# EAGLE design RTD Sesnor (EAGLE 9.6.2)
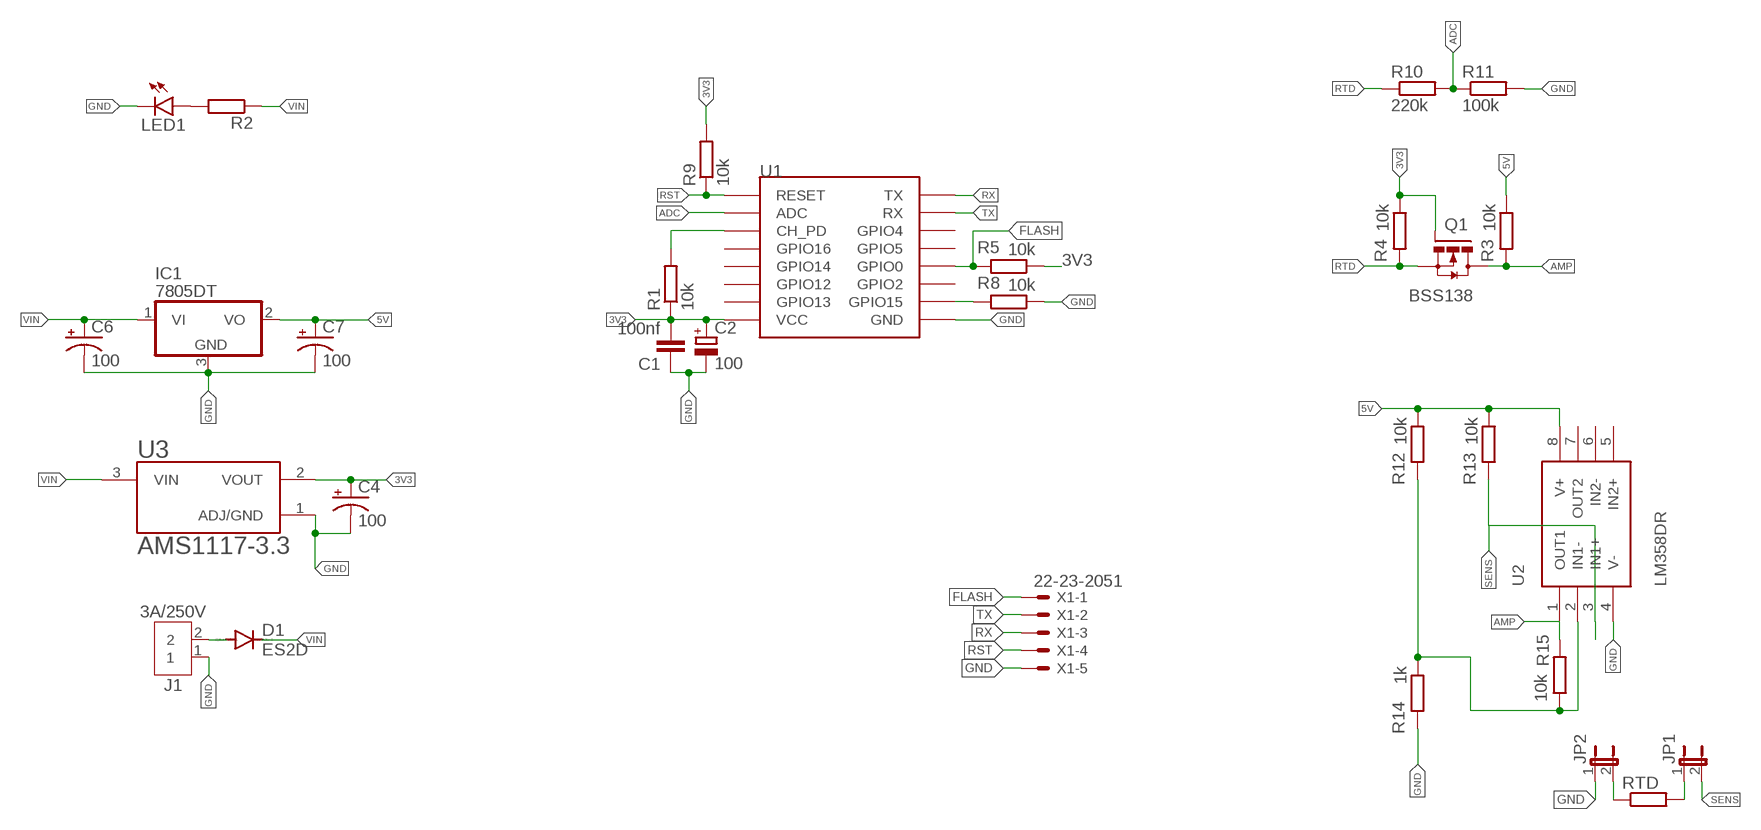
[diagram p0: schematic, sheet 1]

## Parts
C1  100nf  C-EUC0805K  [C0805K]
C2  100  CPOL-EU153CLV-0605  [153CLV-0605]
C4  100  CPOL-US153CLV-0605  [153CLV-0605]
C6  100  CPOL-US153CLV-0605  [153CLV-0605]
C7  100  CPOL-US153CLV-0605  [153CLV-0605]
D1  ES2D  [SMB]
IC1  7805DT  [TO252]
J1  3A/250V  B2B-XH-A  [B2B-XH-A]
JP1  JP1E  [JP1]
JP2  JP1E  [JP1]
LED1  LED3MM  [LED3MM]
Q1  BSS138  [SOT23-3]
R1  10k  R-EU_R1206  [R1206]
R2  R-EU_R1206  [R1206]
R3  10k  R-EU_R1206  [R1206]
R4  10k  R-EU_R1206  [R1206]
R5  10k  R-EU_R1206  [R1206]
R8  10k  R-EU_R1206  [R1206]
R9  10k  R-EU_R1206  [R1206]
R10  220k  R-EU_0204/7  [0204/7]
R11  100k  R-EU_0204/7  [0204/7]
R12  10k  R-EU_R1206  [R1206]
R13  10k  R-EU_R1206  [R1206]
R14  1k  R-EU_R1206  [R1206]
R15  10k  R-EU_R1206  [R1206]
RTD  R-EU_M0805  [M0805]
U1  ESP12SMD  [ESP12-SMD]
U2  LM358DR  [LM358DR]
U3  AMS1117-3.3  [SOT229P700X180-4N]
X1  22-23-2051  [22-23-2051]

## Nets
3V3: C1.2 C2.+ C4.+ Q1.1(G) R1.1 R4.1 R5.1 R9.2 U1.VCC U3.2(VOUT)
5V: C7.+ IC1.2(VO) R3.1 R12.1 R13.1 U2.8(V+)
ADC: R10.2 R11.1 U1.ADC
AMP: Q1.3(D) R3.2 R15.2 U2.1(OUT1)
FLASH: R5.2 U1.GPIO0 X1.1
GND: C1.1 C2.- C4.- C6.- C7.- IC1.3(GND) J1.1 JP2.1 LED1.K(C) R8.1 R11.2 R14.2 U1.GND U2.4(V-) U3.1(ADJ/GND) X1.5
N$1: R1.2 U1.CH_PD
N$2: LED1.A R2.2
N$3: JP2.2 RTD.1
N$4: JP1.1 RTD.2
N$5: R8.2 U1.GPIO15
N$6: D1.A J1.2
N$9: R12.2 R14.1 R15.1 U2.2(IN1-)
RST: R9.1 U1.RESET X1.4
RTD: Q1.2(S) R4.2 R10.1
RX: U1.TXD0(TX) X1.3
SENS: JP1.2 R13.2 U2.3(IN1+)
TX: U1.RXD0(RX) X1.2
VIN: C6.+ D1.C IC1.1(VI) R2.1 U3.3(VIN)
Unconnected: U1.GPIO2 U1.GPIO4 U1.GPIO5 U1.GPIO12 U1.GPIO13 U1.GPIO14 U1.GPIO16 U2.5(IN2+) U2.6(IN2-) U2.7(OUT2)

## Library data of the parts
C1 = rcl:C-EU: CAPACITOR, European symbol; SPICEPREFIX: C
C2 = rcl:CPOL-EU: POLARIZED CAPACITOR, European symbol; SPICEPREFIX: C
C4 C6 C7 = rcl:CPOL-US: POLARIZED CAPACITOR, American symbol; SPICEPREFIX: C
D1 = diode:ES2D: DIODE super fast rectifier, 2 A
IC1 = linear:78*: Positive VOLTAGE REGULATOR Source: http://cache.national.com/ds/LM/LM78L05.pdf http://www.fairchildsemi.com/ds/LM/LM7805.pdf
J1 = Connector:B2B-XH-A: XH Connector Top Entry - 2POS Details see: Datasheet <http://www.jst-mfg.com/product/pdf/eng/eXH.pdf>; CATEGORY: CONNECTOR; DESCRIPTION: 2.5mm pitch/disconnectable crimp style connector; MANUFACTURER: JST (XH CONNECTOR); MPN: B2B-XH-A; OPERATING_TEMPERATURE: -25°C ~ 85°C; PART_STATUS: ACTIVE; ROHS_COMPLIANT: COMPLIANT; SERIES: B_B-XH-A; SUB_CATEGORY: Through hole connector; TYPE: top entry
JP1 JP2 = jumper:JP1E: JUMPER
LED1 = led:LED: LED OSRAM: - CHIPLED LG R971, LG N971, LY N971, LG Q971, LY Q971, LO R971, LY R971 LH N974, LH R974 LS Q976, LO Q976, LY Q976 LO Q996 - Hyper CHIPLED LW Q18S LB Q993, LB Q99A, LB R99A - SideLED LS A670, LO A670, LY A670, LG A670, LP A670 LB A673, LV A673, LT A673, LW A673 LH A674 LY A675 LS A676, LA A676, LO A676, LY A676, LW A676 LS A679, LY A679, LG A679 - Hyper Micro SIDELED® LS Y876, LA Y876, LO Y876, LY Y876 LT Y87S - SmartLED LW L88C, LW L88S LB L89C, LB L89S, LG L890 LS L89K, LO L89K, LY L89K LS L896, LA L896, LO L896, LY L896 - TOPLED LS T670, LO T670, LY T670, LG T670, LP T670 LSG T670, LSP T670, LSY T670, LOP T670, LYG T670 LG T671, LOG T671, LSG T671 LB T673, LV T673, LT T673, LW T673 LH T674 LS T676, LA T676, LO T676, LY T676, LB T676, LH T676, LSB T676, LW T676 LB T67C, LV T67C, LT T67C, LS T67K, LO T67K, LY T67K, LW E67C LS E67B, LA E67B, LO E67B, LY E67B, LB E67C, LV E67C, LT E67C LW T67C LS T679, LY T679, LG T679 LS T770, LO T770, LY T770, LG T770, LP T770 LB T773, LV T773, LT T773, LW T773 LH T774 LS E675, LA E675, LY E675, LS T675 LS T776, LA T776, LO T776, LY T776, LB T776 LHGB T686 LT T68C, LB T68C - Hyper Mini TOPLED® LB M676 - Mini TOPLED Santana® LG M470 LS M47K, LO M47K, LY M47K Source: http://www.osram.convergy.de LUXEON: - LUMILED® LXK2-PW12-R00, LXK2-PW12-S00, LXK2-PW14-U00, LXK2-PW14-V00 LXK2-PM12-R00, LXK2-PM12-S00, LXK2-PM14-U00 LXK2-PE12-Q00, LXK2-PE12-R00, LXK2-PE12-S00, LXK2-PE14-T00, LXK2-PE14-U00 LXK2-PB12-K00, LXK2-PB12-L00, LXK2-PB12-M00, LXK2-PB14-N00, LXK2-PB14-P00, LXK2-PB14-Q00 LXK2-PR12-L00, LXK2-PR12-M00, LXK2-PR14-Q00, LXK2-PR14-R00 LXK2-PD12-Q00, LXK2-PD12-R00, LXK2-PD12-S00 LXK2-PH12-R00, LXK2-PH12-S00 LXK2-PL12-P00, LXK2-PL12-Q00, LXK2-PL12-R00 Source: www.luxeon.com KINGBRIGHT: KA-3528ASYC Source: www.kingbright.com
Q1 = Transistor:BSS138: MOSFET N-CH 50V 220MA SOT-23 Manufacturer's datasheet <https://www.onsemi.com/pub/Collateral/BSS138-D.PDF>; CREATED_BY: PCBLayout.com; DIGIKEY_PART_NUMBER: BSS138CT-ND; MANUFACTURER: ON Semiconductor; MPN: BSS138; PACKAGE: SOT-23
R1-R5 R8-R15 RTD = rcl:R-EU_: RESISTOR, European symbol; SPICEPREFIX: R
U1 = esp8266modules:ESP12: ESP8266 Wifi module 12
U2 = IC:LM358DR: IC OPAMP GP 2 CIRCUIT 8SOIC Manufacturer's datasheet <http://www.ti.com/lit/ds/symlink/lm358.pdf>; CREATED_BY: PCBLayout.com; DIGIKEY_PART_NUMBER: 296-1014-1-ND; MANUFACTURER: Texas Instruments; MPN: LM358DR; PACKAGE: 8-SOIC
U3 = AMS1117-3.3:AMS1117-3.3: Sot223/Pkg 1-Amp 3.3-Volt Low Drop Out Voltage Regulatator; AVAILABILITY: Unavailable; DESCRIPTION: Sot223/Pkg 1-Amp 3.3-Volt Low Drop Out Voltage Regulatator; MF: Advanced Monolithic Systems; MP: AMS1117-3.3; PACKAGE: SOT-89 ams; PRICE: None
X1 = con-molex:22-23-2051: .100" (2.54mm) Center Header - 5 Pin; MF: MOLEX; MPN: 22-23-2051; OC_FARNELL: 1462952; OC_NEWARK: 38C9178

## Board
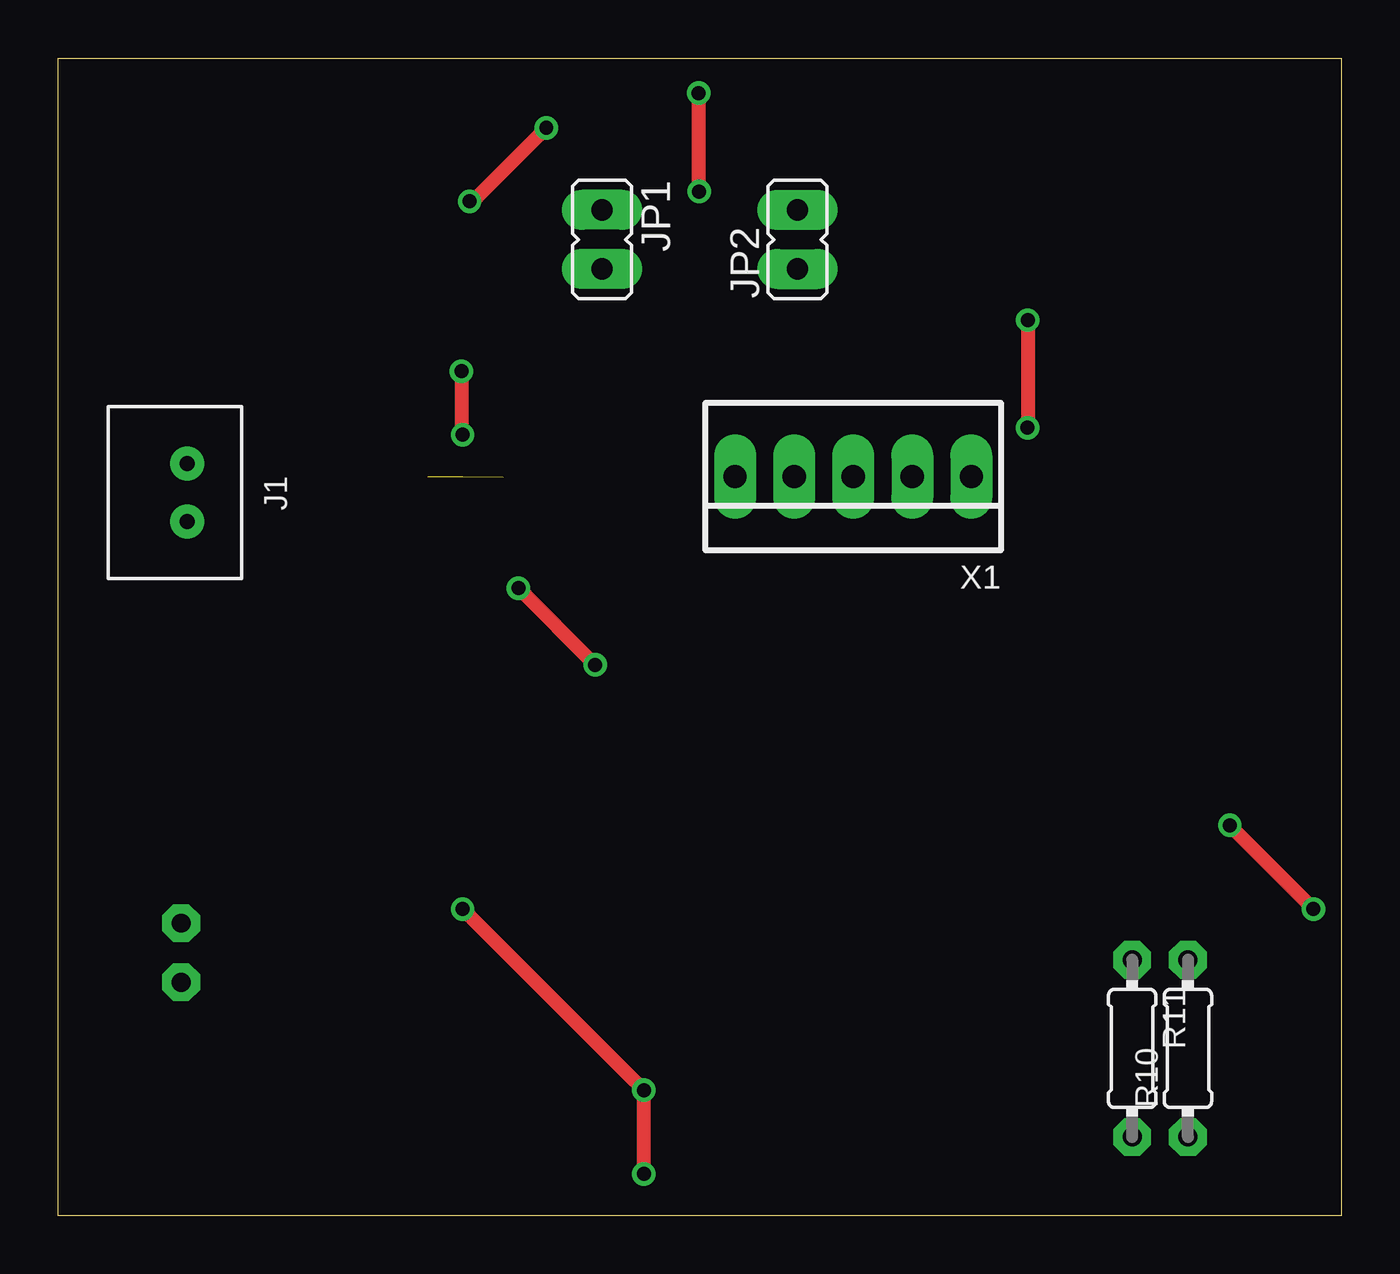
[diagram p1: board, top side]
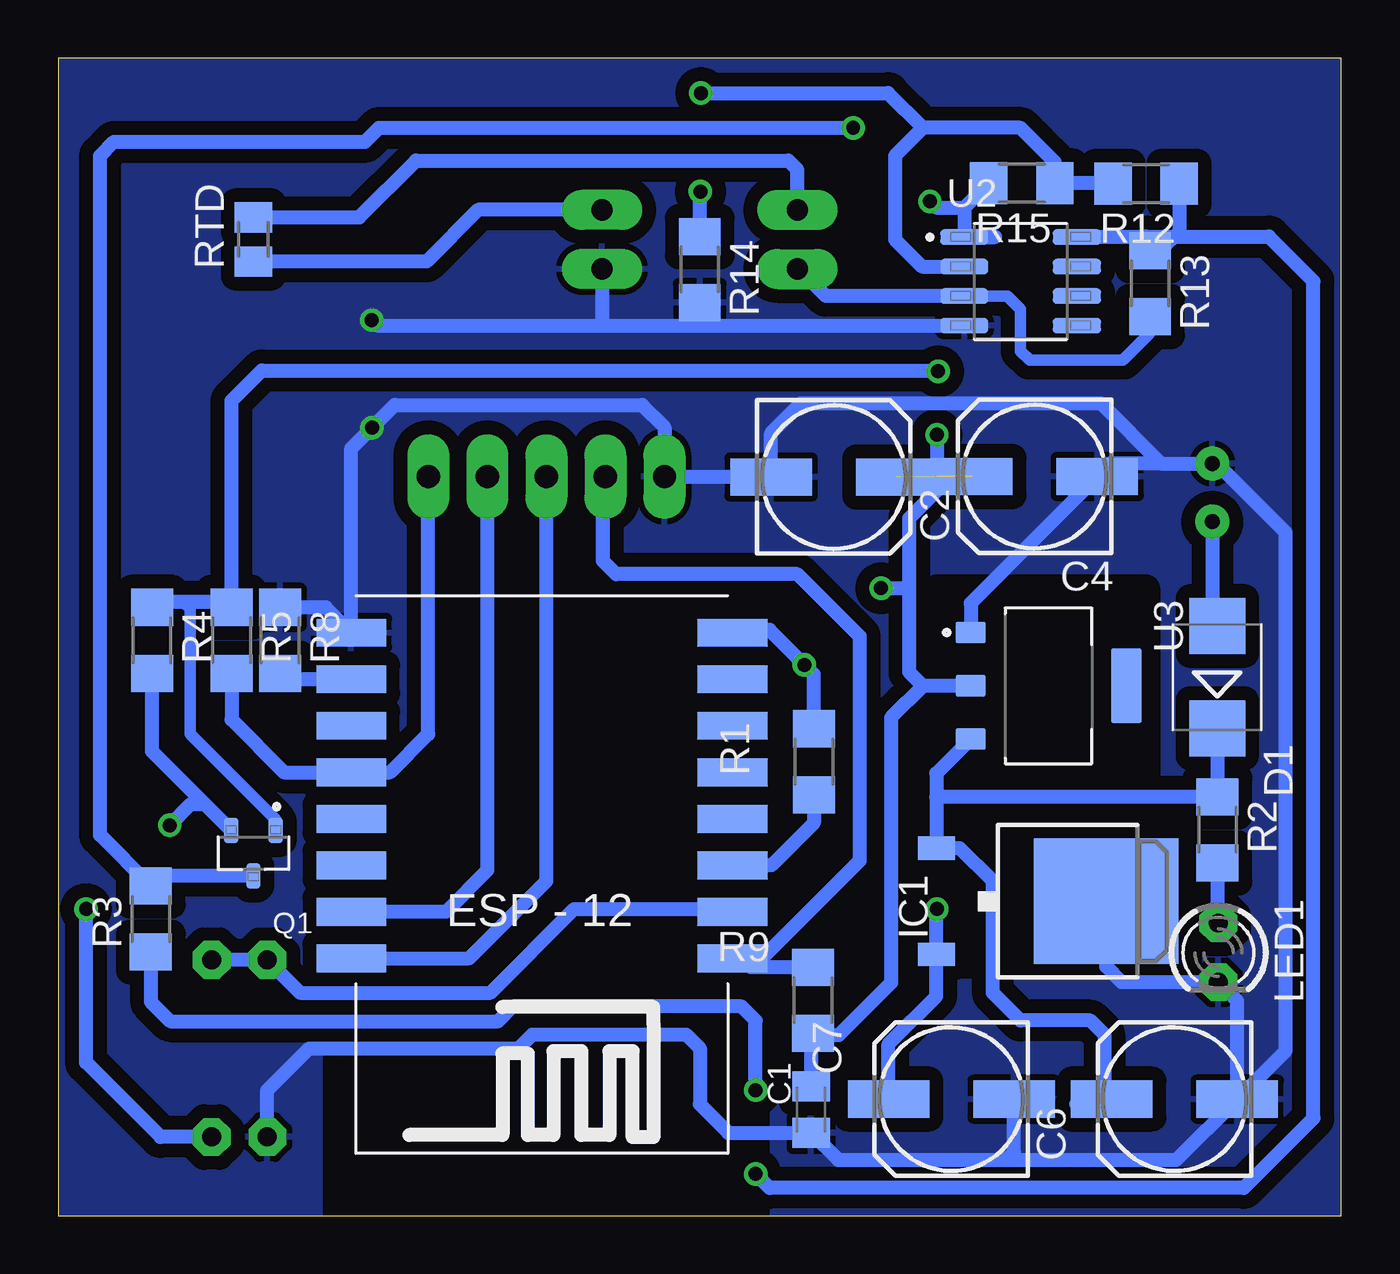
[diagram p2: board, bottom side, seen from below]

Size 55.2 x 49.8 mm. Coordinates in mm from the lower left corner, seen from the top.
Outline: 0,0 0,49.8 55.2,49.8 55.2,0 0,0
Copper layers (1*16): Top 0.035mm / dielectric 1.5mm / Bottom 0.035mm
Design rules "default *": minimum track width 0.5mm, minimum drill 0.6mm, track to track 0.5mm, track to pad 6mil, pad to pad 6mil, via to via 6mil, smd to smd 6mil, copper to edge 0mil, drill to drill 6mil, minimum pad ring 16mil, minimum via ring 8mil, stop-mask expansion 4mil, vias tented up to drill 0mil, thermal gap 10mil
bRestrict: area 25.2,-1.2 to 43.2,9.6; area 6.6,10.8 to 18,16.8; area 8.4,18.6 to 17.4,27

### Footprints (pad centres in the part's own frame; a part is rotated, then mirrored left to right if it is on the bottom)
C0805K = smd 1.3 x 1.6: 1 -1,0; 2 1,0
153CLV-0605 = smd 3.5 x 1.6: + 2.7,0; - -2.7,0
SMB = smd 2.4 x 2.4: A 2.2,0; C -2.2,0
TO252 = smd 1 x 1.6: 1 -2.28,-4.8; 2 2.28,-4.8 | smd 5.4 x 6.2: 3 0,2.5
B2B-XH-A = drill 0.64: 1 0,0; 2 2.5,0
JP1 = drill 0.914 long: 1 0,-1.27; 2 0,1.27
LED3MM = drill 0.813 octagon: A -1.27,0; K 1.27,0
SOT23-3 = smd 0.62 x 1.1: 1 -0.95,-0.975; 2 0.95,-0.975; 3 0,0.975
R1206 = smd 1.6 x 1.803: 1 -1.422,0; 2 1.422,0
0204/7 = drill 0.813 octagon: 1 -3.81,0; 2 3.81,0
M0805 = smd 1.3 x 1.6: 1 -0.95,0; 2 0.95,0
ESP12-SMD = smd 3 x 1.2: ADC -8.3,3.8; CH_PD -8.3,1.8; GND 8.1,-8.2; GPIO0 8.1,-2.2; GPIO2 8.1,-4.2; GPIO4 8.1,1.8; GPIO5 8.1,-0.2; GPIO12 -8.3,-4.2; GPIO13 -8.3,-6.2; GPIO14 -8.3,-2.2; GPIO15 8.1,-6.2; GPIO16 -8.3,-0.2; RESET -8.3,5.8; RXD0 8.1,3.8; TXD0 8.1,5.8; VCC -8.3,-8.2
LM358DR = smd 2.07 x 0.66: 1 -2.42,1.905; 2 -2.42,0.635; 3 -2.42,-0.635; 4 -2.42,-1.905; 5 2.42,-1.905; 6 2.42,-0.635; 7 2.42,0.635; 8 2.42,1.905
SOT229P700X180-4N = smd 0.93 x 1.31: 1 -2.29,-3.345; 2 0,-3.345; 3 2.29,-3.345 | smd 3.24 x 1.31: 4 0,3.345
22-23-2051 = drill 1 long: 1 -5.08,0; 2 -2.54,0; 3 0,0; 4 2.54,0; 5 5.08,0

### Placement (x,y rotation side)
C1  22.81,4.57 90 bottom
C2  21.83,31.78 0 bottom
C4  13.2,31.8 180 bottom
C6  7.18,5.02 180 bottom
C7  16.78,5.02 180 bottom
D1  5.34,23.17 90 bottom
IC1  12.62,13.53 270 bottom
J1  5.55,32.36 270 top
JP1  23.4,42 180 top
JP2  31.8,42 0 top
LED1  5.29,11.32 270 bottom
Q1  46.8,15.6 180 bottom
R1  22.69,19.53 270 bottom
R2  5.33,16.6 270 bottom
R3  51.21,12.77 90 bottom
R4  51.16,24.75 270 bottom
R5  47.74,24.75 270 bottom
R8  45.65,24.75 270 bottom
R9  22.73,9.27 270 bottom
R10  48.6,7.2 90 top
R11  46.2,7.2 270 top
R12  8.4,44.4 180 bottom
R13  8.23,40.1 270 bottom
R14  27.6,40.7 270 bottom
R15  13.75,44.42 180 bottom
RTD  46.8,42 90 bottom
U1  34.49,16.88 180 bottom
U2  13.8,40.2 0 bottom
U3  12.6,22.8 270 bottom
X1  34.2,31.8 180 top

### Tracks (layer width: path | path; a pad name or v marks a point on that pad's centre or on a via)
3V3  (via drill 0.6)  (2 unrouted)
  Top 0.6: v23.1,23.7 v19.8,27 | v17.35,36.33 17.35,33.65 v17.4,33.6
  Bottom 0.5: Q1.1 45.85,17.05 49.52,20.72 49.52,26.12 49.8,26.4
  Bottom 0.6: C4.+ 16.8,31.8 18.6,30 18.6,27 | 18,22.8 18.6,23.4 18.6,27 | U3.2 18,22.8 | R1.1 22.69,23.29 v23.1,23.7 24.6,25.2 26.07,25.2 U1.VCC | v19.8,27 18.6,27 | 18,22.8 19.37,21.43 19.37,10.03 21.63,7.77 22.81,7.77 | R9.2 22.81,7.77 | 22.81,7.77 C1.2 | v17.35,36.33 17.38,36.36 46.44,36.36 47.74,35.06 R5.1 47.96,26.4 49.8,26.4 50.94,26.4 R4.1 | v17.4,33.6 17.4,31.8
5V  (via drill 0.6)
  Top 0.6: v17.4,13.2 v25.2,5.4 v25.2,1.8
  Bottom 0.5: U2.8 10.82,42.1 10.8,42.12 | R13.1 8.23,41.95 8.4,42.12
  Bottom 0.6: C7.+ 19.48,7.39 17.42,9.45 IC1.2 17.42,13.18 v17.4,13.2 | v25.2,5.4 25.2,8.4 25.8,9 35.64,9 36.27,8.37 50.37,8.37 51.21,9.21 R3.1 | v25.2,1.8 24.6,1.2 4.2,1.2 1.2,4.2 1.2,40.2 3.12,42.12 8.4,42.12 10.8,42.12 | R13.1 7.8,41.52 6.98,42.34 R12.1
ADC
  Bottom 0.6: U1.ADC 26.31,13.2 33,13.2 36.6,9.6 44.79,9.6 R11.1 R10.2
AMP  (via drill 0.6)
  Top 0.6: v21,46.8 17.84,43.64 v17.7,43.64
  Bottom 0.6: Q1.3 50.78,14.62 R3.2 53.4,16.38 53.4,45.6 52.8,46.2 42,46.2 41.4,46.8 v21,46.8 | 14.89,42.1 U2.1 16.22,43.37 | R15.2 16.22,43.37 | v17.7,43.64 17.43,43.37 16.22,43.37
FLASH
  Bottom 0.6: X1.1 39.28,20.72 40.92,19.08 U1.GPIO0 45.48,19.08 47.74,21.34 R5.2
GND  (via drill 0.6)
  Top 0.6: v41.71,38.53 v41.71,33.91 v41.7,33.9
  Bottom 0.6: C6.- 4.48,9.24 LED1.K 9.45,10.05 10.12,10.72 IC1.3 | C6.- 2.4,7.1 2.4,29.4 5.36,32.36 J1.1 7.76,32.36 | C6.- 7.1,2.4 14.4,2.4 | 7.76,32.36 9.94,32.36 C4.- 15.95,26.36 U3.1 | 7.76,32.36 10.35,34.95 23.25,34.95 24.53,33.67 C2.- 24.51,31.8 X1.5 29.12,33.92 30.08,34.88 40.72,34.88 v41.7,33.9 42.59,33.01 U1.GND 43.69,26.18 R8.1 | 14.4,2.4 21.64,2.4 C1.1 26.37,3.57 27.6,4.8 27.6,7.2 28.2,7.8 34.8,7.8 35.4,7.2 44.4,7.2 46.2,5.4 R11.2 | 14.4,2.4 14.08,2.72 C7.- | v41.71,38.53 41.48,38.3 31.8,38.3 | 31.8,38.3 27.6,38.3 | 27.6,38.3 U2.4 | JP2.1 31.8,38.3 | R14.2 27.6,38.3
  pour Bottom (isolate 0.6): 55.2,0 0,0 0,49.8 55.2,49.8
N$1
  Bottom 0.6: R1.2 22.69,16.91 24.52,15.08 U1.CH_PD
N$2
  Bottom 0.6: R2.2 5.33,12.63 LED1.A
N$3
  Bottom 0.6: JP2.2 37.13,43.27 39.35,41.05 RTD.1
N$4
  Bottom 0.6: JP1.1 23.4,45 23.79,45.39 39.81,45.39 42.25,42.95 RTD.2
N$5
  Bottom 0.6: U1.GPIO15 45.4,23.08 R8.2
N$6
  Bottom 0.6: J1.2 5.55,24.75 5.4,24.6 5.34,24.66 D1.A
N$9  (via drill 0.6)
  Top 0.6: v27.57,44.06 27.57,47.97 27.6,48 27.6,48.25 v27.55,48.3
  Bottom 0.6: U2.2 18.04,40.84 19.2,42 19.2,45.6 18,46.8 | 18,46.8 13.8,46.8 12.33,45.33 R15.1 9.84,44.42 R12.2 | v27.57,44.06 27.6,44.03 R14.1 | v27.55,48.3 19.5,48.3 18,46.8
RST
  Bottom 0.6: U1.RESET 25.8,11.08 | 25.8,11.08 24.92,11.08 20.72,15.28 20.72,24.92 23.4,27.6 31.2,27.6 31.77,28.17 31.77,31.69 X1.4 | R9.1 25.41,10.69 25.8,11.08
RTD  (via drill 0.6)
  Top 0.6: v54,13.2 v50.4,16.8
  Bottom 0.6: Q1.2 48.89,17.71 | 48.89,17.71 51.16,19.98 R4.2 | R10.1 50.79,3.39 54,6.6 v54,13.2 | v50.4,16.8 49.49,17.71 48.89,17.71
RX
  Bottom 0.6: U1.TXD0 37.52,11.08 34.2,14.4 X1.3
SENS
  Bottom 0.5: U2.3 14.37,39.56 13.8,39 13.8,37.2 13.41,36.81 9.39,36.81 8.23,37.97 R13.2
  Bottom 0.6: 7.65,38.49 R13.2 | U2.3 22.16,39.56 23.33,40.73 JP1.2
TX
  Bottom 0.6: X1.2 36.74,14.86 38.52,13.08 U1.RXD0
VIN
  Bottom 0.6: D1.C 5.34,18.03 | 5.34,18.03 R2.1 | 11.4,4.8 10.1,4.8 C6.+ 10.2,5.34 10.2,7.8 10.8,8.4 13.8,8.4 15,9.6 15,14.4 16.41,15.81 IC1.1 17.42,18 | 5.34,18.03 17.39,18.03 17.42,18 | U3.3 17.42,19.04 17.42,18